# EAGLE design ToF-Module (EAGLE 9.5.1)
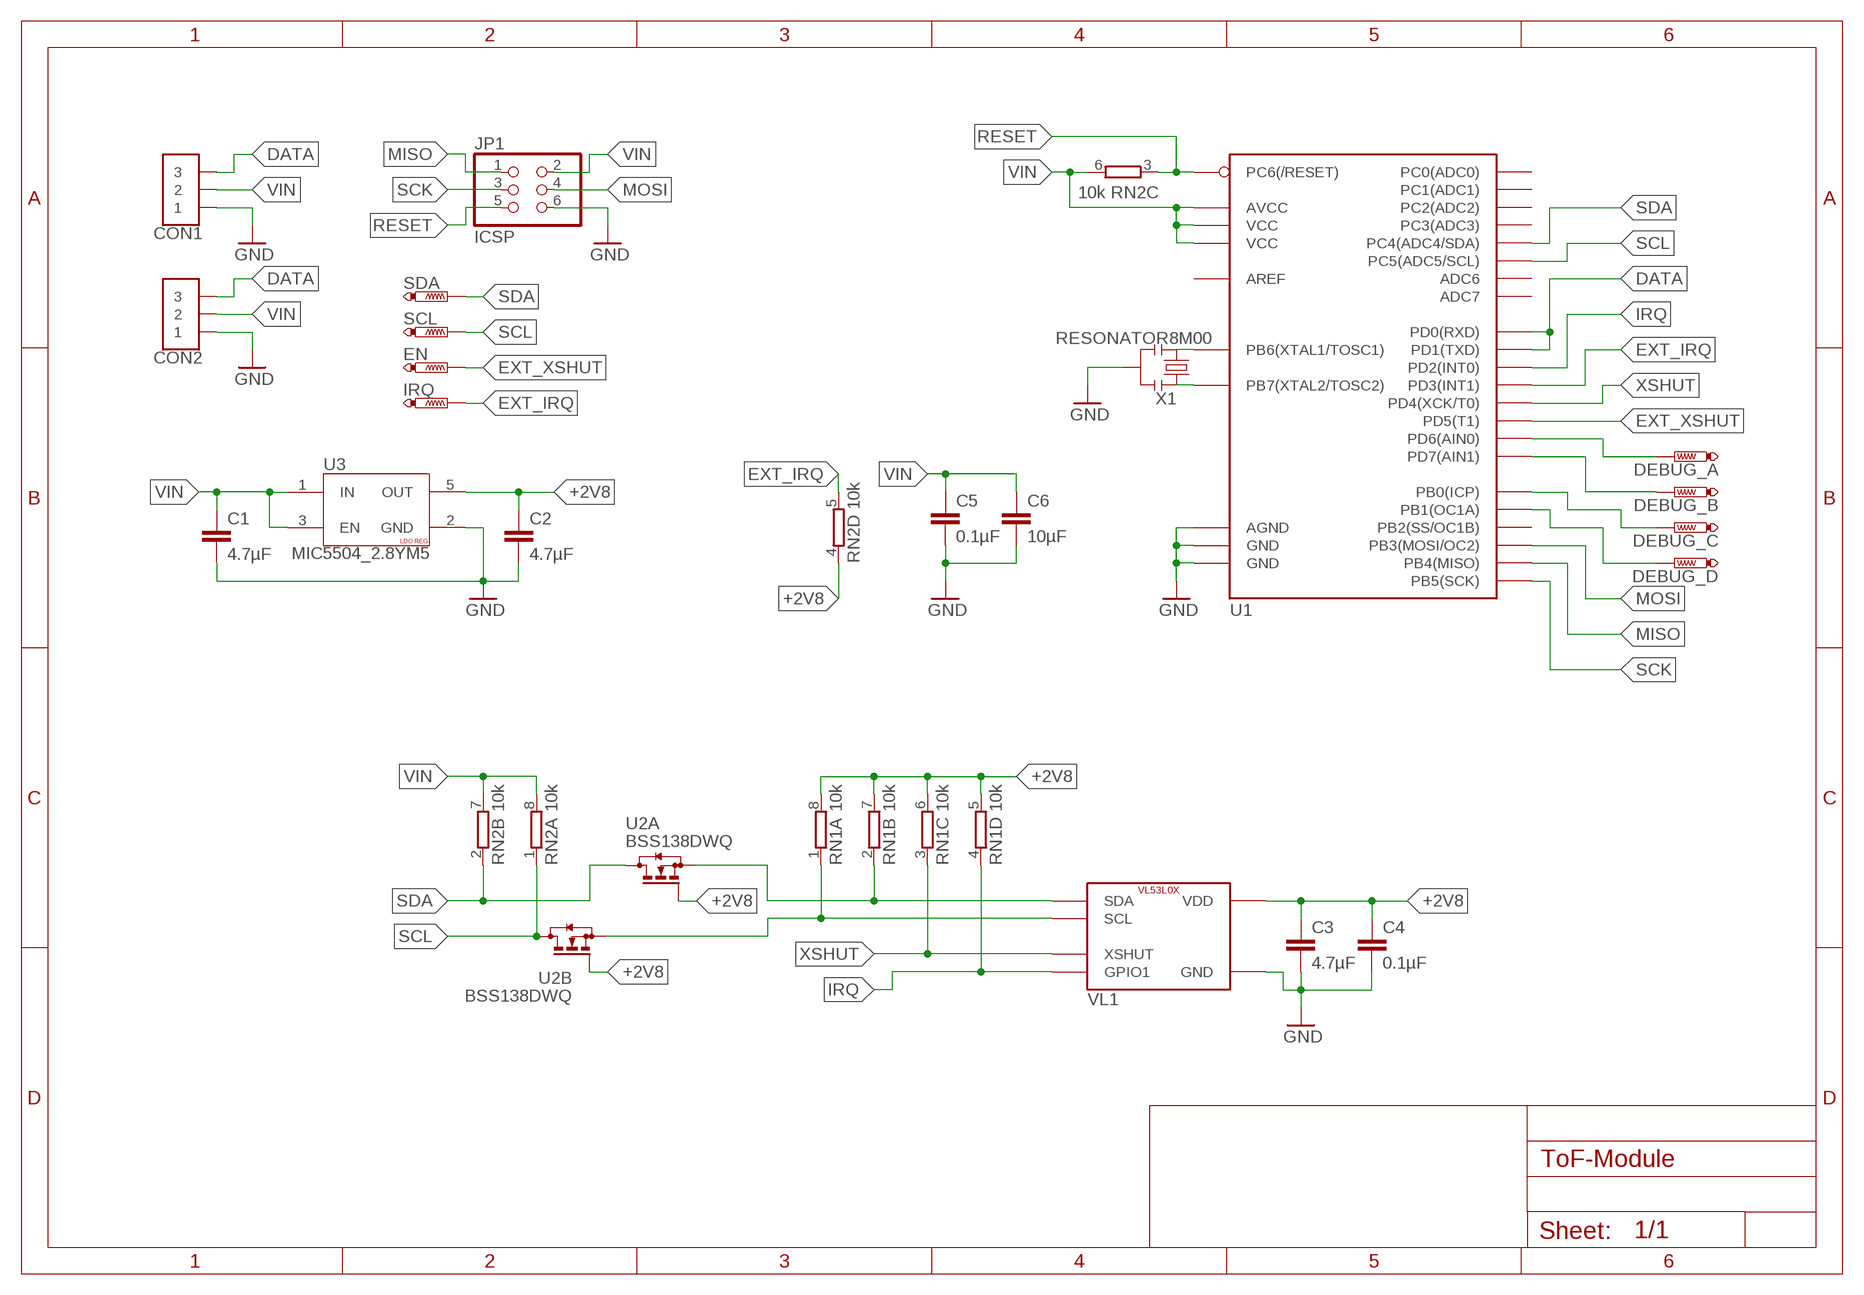
[diagram p0: schematic, sheet 1]

## Parts
C1  4.7µF  C-EUC0603  [C0603]
C2  4.7µF  C-EUC0603  [C0603]
C3  4.7µF  C-EUC0603  [C0603]
C4  0.1µF  C-EUC0603  [C0603]
C5  0.1µF  C-EUC0603  [C0603]
C6  10µF  C-EUC0805  [C0805]
CON1  JST-03  [GH-03-V]
CON2  JST-03  [GH-03-V]
DEBUG_A  PTR1TP15R  [TP15R]
DEBUG_B  PTR1TP15R  [TP15R]
DEBUG_C  PTR1TP15R  [TP15R]
DEBUG_D  PTR1TP15R  [TP15R]
EN  PTR1TP20SQ  [TP20SQ]
IRQ  PTR1TP20SQ  [TP20SQ]
JP1  ICSP  PINHD-2X3  [2X03]
RN1  10k  4R-NCAT16  [CAT16]
RN2  10k  4R-NCAT16  [CAT16]
SCL  PTR1TP20SQ  [TP20SQ]
SDA  PTR1TP20SQ  [TP20SQ]
U1  ATMEGA328P  [QFP80P900X900X120-32]
U2  BSS138DWQ  [SOT65P210X110-6]
U3  MIC5504_2.8YM5  [SOT95P280X145-5]
VL1  VL53L0X  [VL53L0X]
X1  RESONATOR8M00  [CSTNE]

## Nets
+2V8: C2.1 C3.1 C4.1 RN1.5 RN1.6 RN1.7 RN1.8 RN2.4 U2.G1(A:G) U2.G2(B:G) U3.5(OUT) VL1.1(VDD) VL1.11(VDD)
DATA: CON1.3 CON2.3 U1.30(PD0(RXD)) U1.31(PD1(TXD))
EXT_IRQ: IRQ.TP RN2.5 U1.1(PD3(INT1))
EXT_XSHUT: EN.TP U1.9(PD5(T1))
GND: C1.2 C2.2 C3.2 C4.2 C5.2 C6.2 CON1.1 CON2.1 JP1.6 U1.3(GND) U1.5(AGND) U1.21(GND) U3.2(GND) VL1.2(GND) VL1.3(GND) VL1.4(GND) VL1.6(GND) VL1.12(GND) X1.2
IRQ: RN1.4 U1.32(PD2(INT0)) VL1.7(GPIO1)
MISO: JP1.1 U1.16(PB4(MISO))
MOSI: JP1.4 U1.15(PB3(MOSI/OC2))
N$1: DEBUG_A.TP U1.10(PD6(AIN0))
N$2: DEBUG_B.TP U1.11(PD7(AIN1))
N$3: RN1.2 U2.S1(A:S) VL1.9(SDA)
N$4: RN1.1 U2.S2(B:S) VL1.10(SCL)
N$5: U1.7(PB6(XTAL1/TOSC1)) X1.1
N$6: U1.8(PB7(XTAL2/TOSC2)) X1.3
N$7: DEBUG_C.TP U1.12(PB0(ICP))
N$8: DEBUG_D.TP U1.13(PB1(OC1A))
RESET: JP1.5 RN2.3 U1.29(PC6(/RESET))
SCK: JP1.3 U1.17(PB5(SCK))
SCL: RN2.1 SCL.TP U1.28(PC5(ADC5/SCL)) U2.D2(B:D)
SDA: RN2.2 SDA.TP U1.27(PC4(ADC4/SDA)) U2.D1(A:D)
VIN: C1.1 C5.1 C6.1 CON1.2 CON2.2 JP1.2 RN2.6 RN2.7 RN2.8 U1.4(VCC) U1.6(VCC) U1.18(AVCC) U3.1(IN) U3.3(EN)
XSHUT: RN1.3 U1.2(PD4(XCK/T0)) VL1.5(XSHUT)
Unconnected: U1.14(PB2(SS/OC1B)) U1.19(ADC6) U1.20(AREF) U1.22(ADC7) U1.23(PC0(ADC0)) U1.24(PC1(ADC1)) U1.25(PC2(ADC2)) U1.26(PC3(ADC3))

## Library data of the parts
C1-C6 = resistor:C-EU: CAPACITOR, European symbol
CON1 CON2 = con-jst:JST-03
DEBUG_A DEBUG_B DEBUG_C DEBUG_D EN IRQ SCL SDA = testpad:PTR1: TEST PIN
JP1 = pinhead:PINHD-2X3: PIN HEADER
RN1 RN2 = resistor-dil:4R-N: Array Chip Resistor Source: RS Component / Phycomp; MANF: CAT16-103J4LF; MOUSER: 652-CAT16-103J4LF; OC_FARNELL: unknown; OC_NEWARK: unknown; RS: 522-5412
U1 = ToF-Module:ATMEGA328P; MANF: ATMEGA328P-AU; MOUSER: 556-ATMEGA328P-AU
U2 = ToF-Module:BSS138DWQ; MANF: BSS138DWQ-7; MOUSER: 621-BSS138DWQ-7
U3 = ToF-Module:MIC5504; MANF: MIC5504-2.8YM5-TR; MOUSER: 998-MIC5504-2.8YM5TR
VL1 = st-vl-sensor:VL53L0X; MANF: VL53L0CXV0DH/1; MOUSER: 511-VL53L0CXV0DH/1
X1 = ToF-Module:RESONATOR; MANF: CSTNE8M00; MOUSER: 81-CSTNE8M00GH5C000R

## Board
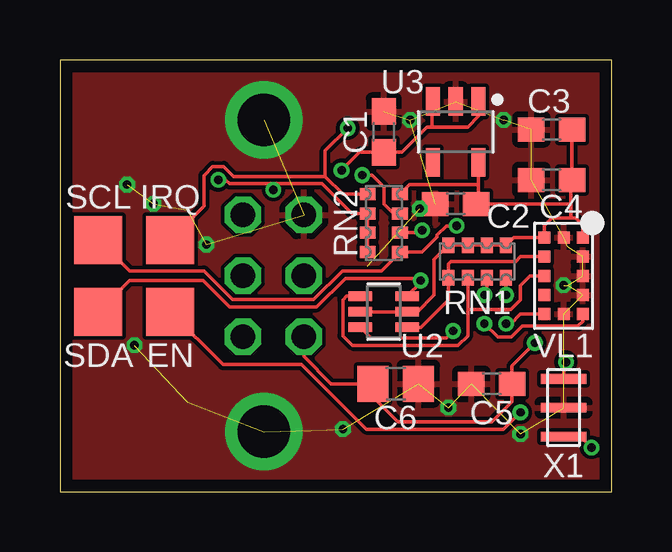
[diagram p1: board, top side]
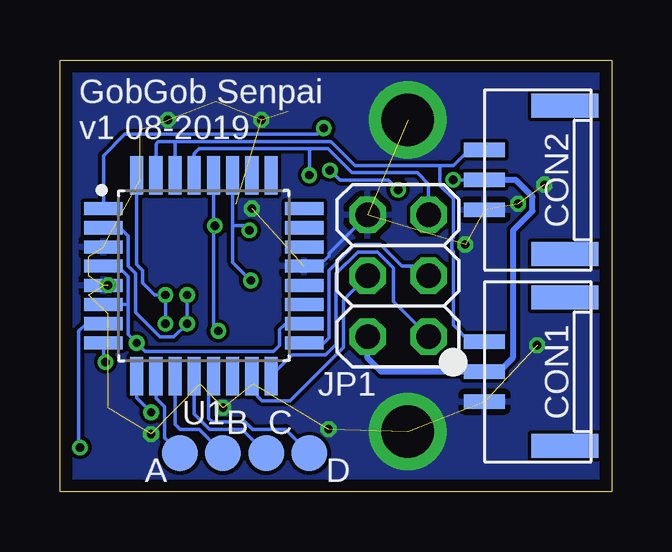
[diagram p2: board, bottom side, seen from below]

Size 23 x 18 mm. Coordinates in mm from the lower left corner, seen from the top.
Outline: 0,0 23,0 23,18 0,18 0,0
Copper layers (1*16): Top 0.035mm / dielectric 1mm / Bottom 0.035mm
Design rules "Elecrow_2-layer_PCB_eagle_rule *": minimum track width 6mil, minimum drill 12mil, track to track 6mil, track to pad 6mil, pad to pad 6mil, via to via 8mil, smd to smd 0mil, copper to edge 20mil, drill to drill 10mil, minimum pad ring 6mil, minimum via ring 6mil, stop-mask expansion 0mil, vias tented up to drill 1mm, thermal gap 10mil
tKeepout: area 0,0 to 11,5; area 0,13 to 11,18
bKeepout: area 6,0 to 11,5; area 6,13 to 11,18

### Footprints (pad centres in the part's own frame; a part is rotated, then mirrored left to right if it is on the bottom)
C0603 = smd 1.1 x 1: 1 -0.85,0; 2 0.85,0
C0805 = smd 1.3 x 1.5: 1 -0.95,0; 2 0.95,0
GH-03-V = smd 0.6 x 1.7: 1 -1.25,2.5; 2 0,2.5; 3 1.25,2.5 | smd 1 x 2.8: CASE0 3.1,-0.85; CASE1 -3.1,-0.85
TP15R = smd 1.5 x 1.5: TP 0,0
TP20SQ = smd 2 x 2: TP 0,0
2X03 = drill 1.016 octagon: 1 -2.54,-1.27; 2 -2.54,1.27; 3 0,-1.27; 4 0,1.27; 5 2.54,-1.27; 6 2.54,1.27
CAT16 = smd 0.5 x 0.65: 1 -1.2,-0.675; 2 -0.4,-0.675; 3 0.4,-0.675; 4 1.2,-0.675; 5 1.2,0.675; 6 0.4,0.675; 7 -0.4,0.675; 8 -1.2,0.675
QFP80P900X900X120-32 = smd 1.6 x 0.547: 1 -4.181,2.8; 2 -4.181,2; 3 -4.181,1.2; 4 -4.181,0.4; 5 -4.181,-0.4; 6 -4.181,-1.2; 7 -4.181,-2; 8 -4.181,-2.8; 17 4.181,-2.8; 18 4.181,-2; 19 4.181,-1.2; 20 4.181,-0.4; 21 4.181,0.4; 22 4.181,1.2; 23 4.181,2; 24 4.181,2.8 | smd 0.547 x 1.6: 9 -2.8,-4.181; 10 -2,-4.181; 11 -1.2,-4.181; 12 -0.4,-4.181; 13 0.4,-4.181; 14 1.2,-4.181; 15 2,-4.181; 16 2.8,-4.181; 25 2.8,4.181; 26 2,4.181; 27 1.2,4.181; 28 0.4,4.181; 29 -0.4,4.181; 30 -1.2,4.181; 31 -2,4.181; 32 -2.8,4.181
SOT65P210X110-6 = smd 0.973 x 0.389: D1 -0.978,-0.65; D2 0.978,0.65; G1 0.978,0; G2 -0.978,0; S1 0.978,-0.65; S2 -0.978,0.65
SOT95P280X145-5 = smd 1.186 x 0.584: 1 -1.264,0.95; 2 -1.264,0; 3 -1.264,-0.95; 4 1.264,-0.95; 5 1.264,0.95
VL53L0X = smd 0.5 x 0.5: 1 1.6,-0.8; 2 0.8,-0.8; 3 0,-0.8; 4 -0.8,-0.8; 5 -1.6,-0.8; 6 -1.6,0; 7 -1.6,0.8; 8 -0.8,0.8; 9 0,0.8; 10 0.8,0.8; 11 1.6,0.8; 12 1.6,0
CSTNE = smd 0.4 x 1.9: 1 -1.2,0; 2 0,0; 3 1.2,0

### Placement (x,y rotation side)
C1  13.5,15 90 top
C2  16.5,12 180 top
C3  20.5,15.1 180 top
C4  20.5,13 180 top
C5  18,4.5 180 top
C6  14,4.5 0 top
CON1  2.8,5 90 bottom
CON2  2.8,13 90 bottom
DEBUG_A  18,1.6 0 bottom
DEBUG_B  16.2,1.6 0 bottom
DEBUG_C  14.4,1.6 0 bottom
DEBUG_D  12.6,1.6 0 bottom
EN  4.6,7.5 0 top
IRQ  4.6,10.5 0 top
JP1  8.9,9 90 bottom
RN1  17.4,9.6 0 top
RN2  13.5,11.2 90 top
SCL  1.6,10.5 0 top
SDA  1.6,7.5 0 top
U1  17,9 0 bottom
U2  13.5,7.5 180 top
U3  16.5,15 270 top
VL1  21,9 90 top
X1  21,3.5 90 top

### Tracks (layer width: path | path; a pad name or v marks a point on that pad's centre or on a via)
+2V8
  Top 0.152: 21.3,11.4 20.5,11.4 20.2,11.1 VL1.11 18.93,10.6 RN1.5 RN1.6 RN1.7 RN1.8 15.6,9.68 15.6,8.2 14.9,7.5 U2.G2 U2.G1 | 21.3,11.4 21.5,11.4 21.8,11.1 VL1.1 | 21.3,12 21.3,12.95 C4.1 C3.1 | 21.3,12 21.3,11.4 | U3.5 17.45,12.8 | 17.45,12.8 17.45,12.1 C2.1 21.3,12 | RN2.4 14.57,12.8 17.45,12.8
DATA
  Bottom 0.152: CON1.3 5.9,6.25 6.6,6.95 6.6,10.01 6.66,10.07 6.66,10.53 6.6,10.59 6.6,12.21 7.16,12.77 7.16,13.6 | CON2.3 5.95,14.25 6.6,13.6 7.16,13.6 | 18.2,14.6 U1.30 | U1.31 19,14.5 18.9,14.6 18.2,14.6 | 18.2,14.6 11.7,14.6 10.7,13.6 7.16,13.6
EXT_IRQ  (via drill 0.35)
  Top 0.152: IRQ.TP 6,11.9 6,13.19 6.37,13.56 6.83,13.56 7.25,13.14 11.06,13.14 | RN2.5 11.8,12.4 11.06,13.14 | 11.06,13.14 11.06,14.22 v12,15.16
  Bottom 0.152: U1.1 21.18,14.02 20.3,14.9 12.25,14.9 v12,15.16
EXT_XSHUT  (via drill 0.35)
  Top 0.152: EN.TP 6.8,5.3 10.07,5.3 12.77,2.6 18.5,2.6 v19.2,3.3
  Bottom 0.152: v19.2,3.3 19.8,3.9 U1.9
GND  (via drill 0.35, 2.2, 2.2 pad 3.2)  (29 unrouted)
  Top 0.152: C2.2 15.45,11.8 v15,11.8
  Bottom 0.152: JP1.6 11.79,9.92 11.79,9.83 12.22,9.4 U1.21
  other vias: 21,8.6 8.5,15.5 8.5,2.5 3.9,12 6.1,10.3 16.2,3.5 18.5,15.5 14.6,15.5 2.8,12.8 3.1,6.1 19.2,2.4 11.8,2.6
  pour Top: 0,18 23,18 23,0 0,0
  pour Bottom: 0,18 0,0 23,0 23,18
IRQ  (via drill 0.35)
  Top 0.152: RN1.4 v18.6,8.2 | v18.6,7 18.8,7 19.2,7.4 VL1.7
  Bottom 0.152: U1.32 19.8,9.48 19.54,9.22 19.54,8.7 19.04,8.2 v18.6,8.2 v18.6,7
MISO
  Bottom 0.152: JP1.1 9.1,7.93 9.1,9.33 9.76,9.99 10.58,9.99 11.48,9.09 11.48,6.14 11.92,5.7 13.32,5.7 U1.16
MOSI
  Bottom 0.152: JP1.4 10.88,8.29 11.18,7.99 11.18,6.01 13.4,3.79 14.57,3.79 15,4.22 U1.15
N$1
  Bottom 0.152: U1.10 19,3.89 18.64,3.53 18.64,2.24 DEBUG_A.TP
N$2
  Bottom 0.152: U1.11 18.2,2.8 18,2.6 17.2,2.6 DEBUG_B.TP
N$3
  Top 0.152: VL1.9 19.6,9 19.2,8.6 19.2,8 18.8,7.6 17,7.6 | U2.S1 11.95,8.15 11.8,8 11.8,6.5 12.2,6.1 16.6,6.1 17,6.5 17,7.6 | 17,7.6 RN1.2
N$4
  Top 0.152: VL1.10 19.2,9.8 19,9.6 16.3,9.6 16.2,9.5 RN1.1 16.2,8 15.05,6.85 U2.S2
N$5  (via drill 0.35)
  Top 0.152: v22.16,1.84 21.7,2.3 X1.1
  Bottom 0.152: U1.7 21.9,7 22.21,6.69 22.21,1.88 v22.16,1.84
N$6  (via drill 0.35)
  Top 0.152: v21.1,5.4 21,5.3 X1.3
  Bottom 0.152: U1.8 21.18,5.48 v21.1,5.4
N$7
  Bottom 0.152: DEBUG_C.TP 15.4,2.6 16.77,2.6 17.4,3.23 U1.12
N$8
  Bottom 0.152: U1.13 16.8,4.62 16.8,3.06 16.64,2.9 15.27,2.9 14.97,2.6 13.6,2.6 DEBUG_D.TP
RESET  (via drill 0.35)
  Top 0.152: RN2.3 13.9,11.6 13.5,12 13.5,12.7 13,13.2 v12.6,13.2
  Bottom 0.152: JP1.5 7.63,12.83 8.1,13.29 10.83,13.29 11.83,14.29 12.6,14.29 | U1.29 17.4,14.1 17.2,14.29 12.6,14.29 | v12.6,13.2 12.6,14.29
SCK
  Bottom 0.152: JP1.3 8.03,9.4 8.74,9.4 9.63,10.29 10.71,10.29 11.79,9.21 11.79,6.41 12,6.2 U1.17
SCL  (via drill 0.35)
  Top 0.152: U2.D2 12.97,6.41 16.11,6.41 v16.4,6.7 | v16.54,11.08 16.11,11.08 15.72,10.7 15.72,10.62 15.1,10 RN2.1 14.18,9.97 13.4,9.2 11.77,9.2 10.58,8.01 7.19,8.01 6,9.2 2.9,9.2 SCL.TP
  Bottom 0.152: v16.4,6.7 16.6,6.9 16.6,11.14 | 16.6,11.14 U1.28 | v16.54,11.08 16.6,11.14
SDA  (via drill 0.35)
  Top 0.152: U2.D1 15.04,8.72 v15.04,8.8 14.95,8.89 11.9,8.89 10.71,7.71 7.06,7.71 5.97,8.8 2.9,8.8 SDA.TP | RN2.2 15,10.8 v15.1,10.9
  Bottom 0.152: v15.04,8.8 15.8,9.56 15.8,11.1 | 15.8,11.1 U1.27 | v15.1,10.9 15.3,11.1 15.8,11.1
VIN  (via drill 0.35)
  Top 0.152: v19.8,6.2 18.85,5.25 C5.1 18.85,3.75 18,2.9 14.1,2.9 13.05,3.95 C6.1 11.3,4.5 10.17,5.63 JP1.2 | v6.6,13 6.9,13 7.07,12.84 8.9,12.84 | 15.5,15.2 15.3,15.2 14.25,14.15 C1.1 12.49,14.15 v11.74,13.4 | 15.5,15.2 17,15.2 17.45,15.65 U3.1 | U3.3 15.5,16.21 15.5,15.2 | RN2.8 RN2.7 RN2.6 12.17,11.6 10.93,12.84 8.9,12.84 | v8.9,12.58 8.9,12.84
  Bottom 0.152: U1.4 20.59,9.4 20.15,8.97 20.15,7.8 | 20.15,7.8 20.15,6.55 v19.8,6.2 19.45,5.85 14.1,5.85 13.85,6.1 13.85,6.75 13.6,7 U1.18 | CON2.2 v6.6,13 | U1.6 20.15,7.8 | v11.74,13.4 11.33,12.99 9.31,12.99 v8.9,12.58
  Bottom 0.254: JP1.2 10.17,5.57 9.6,5 CON1.2 4.7,5 4.1,5.6 4.1,10.9 3.29,11.71 3.29,12.29 4,13 CON2.2
XSHUT  (via drill 0.35)
  Top 0.152: RN1.3 17.8,8.3 v17.7,8.2 | VL1.5 21.8,7.1 21.6,6.9 19.29,6.9 18.83,6.44 18.26,6.44 v17.7,7
  Bottom 0.152: U1.2 20.5,11 20.15,10.65 20.15,9.4 19.85,9.09 19.85,7.46 18.83,6.44 18.26,6.44 v17.7,7 v17.7,8.2

### Text on the board
bPlace: GobGob Senpai / v1 08-2019 | C | B | D | A